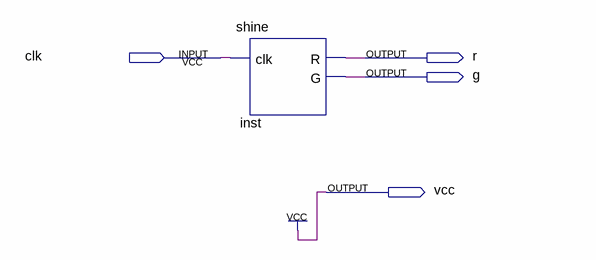
[diagram p0: schematic sheet]
// Quartus schematic shine.bdf as structural Verilog: 1 symbols, 4 pins
module shine (
  input  clk,
  output r,
  output g,
  output vcc
);

  shine inst (.clk(clk), .R(r), .G(g));

  assign vcc = 1'b1;
endmodule
